# Altium schematic sheet 1_SCH_RP2040.schdoc
size 307 x 218 mm; Symbol: Sheet-Symbol_A4; Device: Sheet-Symbol_A4; Drawed: LCEDA_02; Version: V1.2; Page Size: A4; @Project Name: rp2040 board; @Page Count: 1; @Update Date: 2026-03-04; @Create Date: 2026-03-04; @Schematic Name: SCH_RP2040; Part Number: JLCPCB_01; @Page No: 1; @Page Name: SCH_RP2040; @Board Name: Board1; @Create Time: 12:52:45; @Update Time: 15:37:57; Width: 1170; Height: 825; Region Start: 1; X Region Count: 6; Y Region Count: 4; Blade Width: 10; Title Block Position: 3; Author: Shounak Das
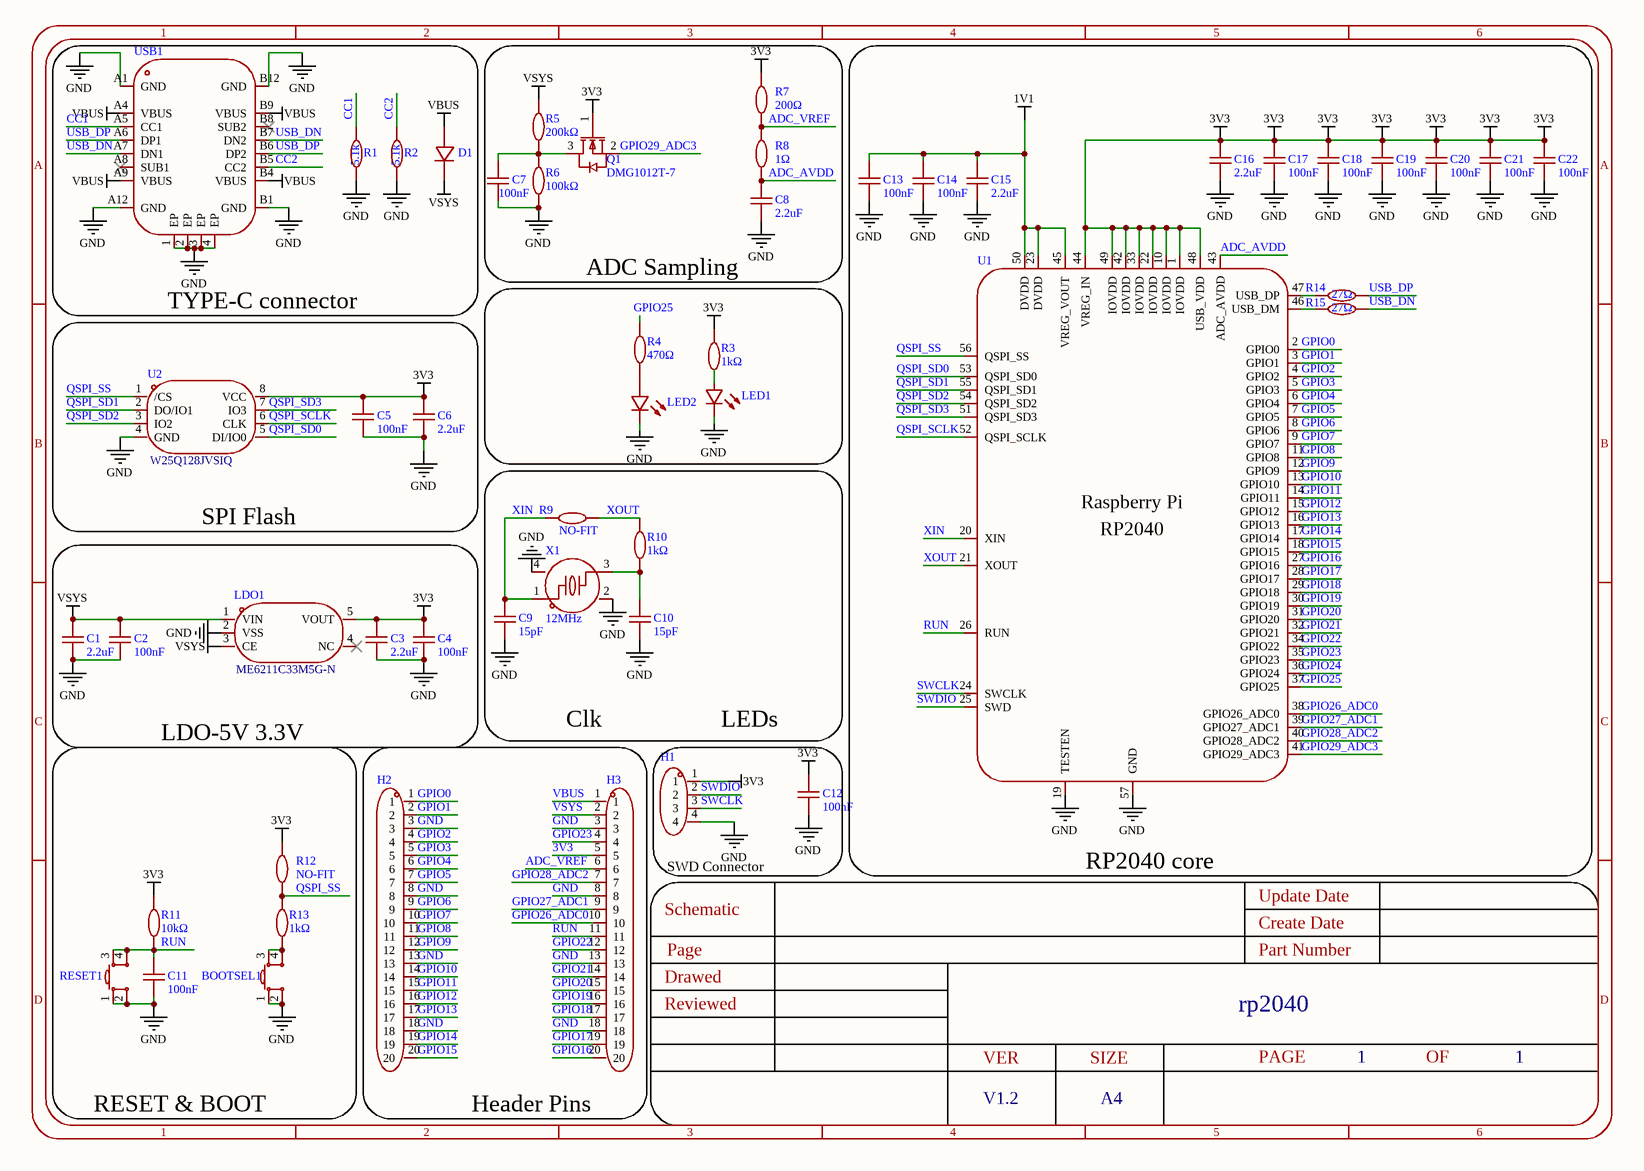
[diagram p0: 1_SCH_RP2040.schdoc]

## Parts
BOOTSEL1  PTS815SJK250SMTRLFS  [SW-SMD_4P-L4.2-W3.3-P2.15-LS5.1]  (value not drawn)
C1  2.2uF  [C0603]
C2  100nF  [C0603]
C3  2.2uF  [C0603]
C4  100nF  [C0603]
C5  100nF  [C0603]
C6  2.2uF  [C0603]
C7  100nF  [C0603]
C8  2.2uF  [C0603]
C9  15pF  [C0603]
C10  15pF  [C0603]
C11  100nF  [C0603]
C12  100nF  [C0603]
C13  100nF  [C0603]
C14  100nF  [C0603]
C15  2.2uF  [C0603]
C16  2.2uF  [C0603]
C17  100nF  [C0603]
C18  100nF  [C0603]
C19  100nF  [C0603]
C20  100nF  [C0603]
C21  100nF  [C0603]
C22  100nF  [C0603]
D1  1N4007W  [SOD-123FL_L2.7-W1.8-LS3.8-RD]  (value not drawn)
H1  DZ254W-11-04-65  [HDR-TH_4P-P2.54-H-M-W10.3]  (value not drawn)
H2  12251120CNG0S115005  [HDR-TH_20P-P2.54-V-M-1]  (value not drawn)
H3  12251120CNG0S115005  [HDR-TH_20P-P2.54-V-M-1]  (value not drawn)
LDO1  ME6211C33M5G-N  [SOT-23-5_L3.0-W1.7-P0.95-LS2.8-BR]
LED1  NCD0603R1  [LED0603-RD_RED]  (value not drawn)
LED2  19-217/BHC-ZL1M2RY/3T  [LED0603-R-RD_BLUE]  (value not drawn)
Q1  DMG1012T-7  [SOT-523-3_L1.6-W0.8-P1.00-LS1.6-BR]
R1  5.1k  [R0603]
R2  5.1k  [R0603]
R3  1kΩ  [R0603]
R4  470Ω  [R0603]
R5  200kΩ  [R0603]
R6  100kΩ  [R0603]
R7  200Ω  [R0603]
R8  1Ω  [R0603]
R9  NO-FIT  [R0603]
R10  1kΩ  [R0603]
R11  10kΩ  [R0603]
R12  NO-FIT  [R0603]
R13  1kΩ  [R0603]
R14  27Ω  [R0603]
R15  27Ω  [R0603]
RESET1  PTS815SJK250SMTRLFS  [SW-SMD_4P-L4.2-W3.3-P2.15-LS5.1]  (value not drawn)
U1  RP2040  [LQFN-56_L7.0-W7.0-P0.4-EP]  (value not drawn)
U2  W25Q128JVSIQ  [SOIC-8_L5.3-W5.3-P1.27-LS8.0-BL]
USB1  KH-TYPE-C-16P  [USB-C-SMD_KH-TYPE-C-16P]  (value not drawn)
X1  12MHz  [CRYSTAL-SMD_4P-L3.2-W2.5-BL]

## Blocks framed on the sheet
TYPE-C connector: D1 R1 R2 USB1
RP2040 core: C13-C22 R14 R15 U1
ADC Sampling: LED1 LED2 R3 R4
Clk: C9 C10 R9 R10 X1
Header Pins: H2 H3
LEDs: C12 H1

## Nets
1V1: C13.1 C14.2 C15.2 U1.23(DVDD) U1.45(VREG_VOUT) U1.50(DVDD)
3V3: C3.2 C4.2 C5.2 C6.2 C12.1 C16.1 C17.2 C18.2 C19.2 C20.2 C21.2 C22.2 H1.1 H3.5 LDO1.5(VOUT) Q1.1(G) R3.2 R7.2 R11.2 R12.1 U1.1(IOVDD) U1.10(IOVDD) U1.22(IOVDD) U1.33(IOVDD) U1.42(IOVDD) U1.44(VREG_IN) U1.48(USB_VDD) U1.49(IOVDD) U2.8(VCC)
GND: BOOTSEL1.1 BOOTSEL1.2 C1.1 C2.1 C3.1 C4.1 C5.1 C6.1 C7.1 C8.1 C9.2 C10.2 C11.1 C12.2 C13.2 C14.1 C15.1 C16.2 C17.1 C18.1 C19.1 C20.1 C21.1 C22.1 H1.4 H2.3 H2.8 H2.13 H2.18 H3.3 H3.8 H3.13 H3.18 LDO1.2(VSS) LED1.1(K) LED2.1(C) R1.1 R2.1 R6.1 RESET1.1 RESET1.2 U1.19(TESTEN) U1.57(GND) U2.4(GND) USB1.1(EP) USB1.2(EP) USB1.3(EP) USB1.4(EP) USB1.A1(GND) USB1.A12(GND) USB1.B1(GND) USB1.B12(GND) X1.2(GND) X1.4(GND)
VBUS: D1.2(A) H3.1 USB1.A4(VBUS) USB1.A9(VBUS) USB1.B4(VBUS) USB1.B9(VBUS)
VSYS: C1.2 C2.2 D1.1(K) H3.2 LDO1.1(VIN) LDO1.3(CE) R5.2
ADC_AVDD: C8.2 R8.1 U1.43(ADC_AVDD)
ADC_VREF: H3.6 R7.1 R8.2
CC1: R1.2 USB1.A5(CC1)
CC2: R2.2 USB1.B5(CC2)
GPIO0: H2.1 U1.2(GPIO0)
GPIO1: H2.2 U1.3(GPIO1)
GPIO2: H2.4 U1.4(GPIO2)
GPIO3: H2.5 U1.5(GPIO3)
GPIO4: H2.6 U1.6(GPIO4)
GPIO5: H2.7 U1.7(GPIO5)
GPIO6: H2.9 U1.8(GPIO6)
GPIO7: H2.10 U1.9(GPIO7)
GPIO8: H2.11 U1.11(GPIO8)
GPIO9: H2.12 U1.12(GPIO9)
GPIO10: H2.14 U1.13(GPIO10)
GPIO11: H2.15 U1.14(GPIO11)
GPIO12: H2.16 U1.15(GPIO12)
GPIO13: H2.17 U1.16(GPIO13)
GPIO14: H2.19 U1.17(GPIO14)
GPIO15: H2.20 U1.18(GPIO15)
GPIO16: H3.20 U1.27(GPIO16)
GPIO17: H3.19 U1.28(GPIO17)
GPIO18: H3.17 U1.29(GPIO18)
GPIO19: H3.16 U1.30(GPIO19)
GPIO20: H3.15 U1.31(GPIO20)
GPIO21: H3.14 U1.32(GPIO21)
GPIO22: H3.12 U1.34(GPIO22)
GPIO23: H3.4 U1.35(GPIO23)
GPIO24: U1.36(GPIO24)
GPIO25: U1.37(GPIO25)
GPIO26_ADC0: H3.10 U1.38(GPIO26_ADC0)
GPIO27_ADC1: H3.9 U1.39(GPIO27_ADC1)
GPIO28_ADC2: H3.7 U1.40(GPIO28_ADC2)
GPIO29_ADC3: Q1.2(S) U1.41(GPIO29_ADC3)
QSPI_SCLK: U1.52(QSPI_SCLK) U2.6(CLK)
QSPI_SD0: U1.53(QSPI_SD0) U2.5(DI/IO0)
QSPI_SD1: U1.55(QSPI_SD1) U2.2(DO/IO1)
QSPI_SD2: U1.54(QSPI_SD2) U2.3(IO2)
QSPI_SD3: U1.51(QSPI_SD3) U2.7(IO3)
QSPI_SS: R12.2 R13.2 U1.56(QSPI_SS) U2.1(/CS)
RUN: C11.2 H3.11 R11.1 RESET1.3 RESET1.4 U1.26(RUN)
SWCLK: H1.3 U1.24(SWCLK)
SWDIO: H1.2 U1.25(SWD)
USB_DN: R15.2 USB1.A7(DN1) USB1.B7(DN2)
USB_DP: R14.2 USB1.A6(DP1) USB1.B6(DP2)
XIN: C9.1 R9.1 U1.20(XIN) X1.1
XOUT: R9.2 R10.2 U1.21(XOUT)
NetBOOTSEL1_3: BOOTSEL1.3 BOOTSEL1.4 R13.1
NetC7_2: C7.2 Q1.3(D) R5.1 R6.2
NetC10_1: C10.1 R10.1 X1.3
NetLED1_2: LED1.2(A) R3.1
NetLED2_2: LED2.2(A) R4.1
NetR14_1: R14.1 U1.47(USB_DP)
NetR15_1: R15.1 U1.46(USB_DM)

Not connected (* = marked no-connect by the designer): LDO1 4(NC)*; R4 2; USB1 A8(SUB1)* B8(SUB2)*

## Notes on the sheet
- SPI Flash
- LDO-5V 3.3V
- SWD Connector
- RESET & BOOT
- Labels drawn without touching a wire or pin: GPIO25
- 1
- 2
- 3
- 4
- 5
- 6
- A
- B
- C
- Schematic
- Create Date
- Update Date
- Drawed
- Page
- Part Number
- D
- Reviewed
- VER
- SIZE
- PAGE
- rp2040
- OF
- V1.2
- A4
- (in symbol RP2040_C2040) Raspberry Pi

## Library data of the parts
BOOTSEL1 RESET1 = PTS815SJK250SMTRLFS: Manufacturer: C&K; Add into BOM: yes; Symbol: PTS815SJK250SMTRLFS; Device: PTS815SJK250SMTRLFS; LCSC Part Name: 轻触开关; Supplier Part: C918859; Manufacturer Part: PTS815SJK250SMTRLFS; Supplier Footprint: SMD; JLCPCB Part Class: 扩展库; Datasheet: https://atta.szlcsc.com/upload/public/pdf/source/20190916/C411883_4F77F16E1D8E48DC707D8949CEE7CF80.pdf; Supplier: LCSC; Convert to PCB: yes
C1 C3 C6 C8 C15 C16 = CL10A225KO8NNNC: Manufacturer: SAMSUNG(三星); Add into BOM: yes; Tolerance: ±10%; Voltage Rated: 16V; Temperature Coefficient: X5R; Symbol: CL10A225KO8NNNC; Device: CL10A225KO8NNNC; LCSC Part Name: 2.2uF ±10% 16V; Supplier Part: C23630; Manufacturer Part: CL10A225KO8NNNC; Supplier Footprint: 0603; JLCPCB Part Class: 基础库; Datasheet: https://atta.szlcsc.com/upload/public/pdf/source/20160103/1457707709512.pdf; Supplier: LCSC; Convert to PCB: yes; Value: 2.2uF
C2 C4 C5 C7 C11-C14 C17-C22 = 0603B104K500NT: Manufacturer: FH(风华); Add into BOM: yes; Tolerance: ±10%; Voltage Rated: 50V; Temperature Coefficient: X7R; Symbol: 0603B104K500NT; Device: 0603B104K500NT; LCSC Part Name: 100nF ±10% 50V; Supplier Part: C30926; Manufacturer Part: 0603B104K500NT; Supplier Footprint: 0603; JLCPCB Part Class: 扩展库; Datasheet: https://atta.szlcsc.com/upload/public/pdf/source/20170923/C30926_1506149436298988724.pdf; Supplier: LCSC; Convert to PCB: yes; Value: 100nF
C9 C10 = CC0603JRNPO9BN150: Manufacturer: YAGEO(国巨); Add into BOM: yes; Tolerance: ±5%; Voltage Rated: 50V; Temperature Coefficient: NP0; Symbol: CC0603JRNPO9BN150; Device: CC0603JRNPO9BN150; LCSC Part Name: 15pF ±5% 50V; Supplier Part: C107037; Manufacturer Part: CC0603JRNPO9BN150; Supplier Footprint: 0603; JLCPCB Part Class: 扩展库; Datasheet: https://atta.szlcsc.com/upload/public/pdf/source/20170420/1492670688140.pdf; Supplier: LCSC; Convert to PCB: yes; Value: 15pF
D1 = 1N4007W_C108803: Manufacturer: 晶导微电子; Add into BOM: yes; Diode Configuration: 独立式; Reverse Voltage (Vr): 1kV; Average Rectified Current (Io): 1A; Forward Voltage (Vf@If): 1.1V@1A; Reverse Leakage Current: 5uA@1kV; Symbol: 1N4007W; Device: 1N4007W_C108803; LCSC Part Name: 1kV 1A 1.1V@1A; Supplier Part: C108803; Manufacturer Part: 1N4007W; Supplier Footprint: SOD-123FL; JLCPCB Part Class: 扩展库; Datasheet: https://atta.szlcsc.com/upload/public/pdf/source/20170418/1492506332394.pdf; Supplier: LCSC; Convert to PCB: yes
H1 = DZ254W-11-04-65: Manufacturer: DEALON(德艺隆); Add into BOM: yes; Pitch: 2.54mm; Pin Structure: 1x4P; Circluar Pins/Square Pins: 方针; Current Rating (Max): 3A; Symbol: DZ254W-11-04-65; Device: DZ254W-11-04-65; LCSC Part Name: 2.54mm 1x4P 弯插 方针; Supplier Part: C2935929; Manufacturer Part: DZ254W-11-04-65; Supplier Footprint: 弯插,P=2.54mm; JLCPCB Part Class: 扩展库; Datasheet: https://atta.szlcsc.com/upload/public/pdf/source/20211231/CEC96EEC99F3217E207F74B399519373.pdf; Supplier: LCSC; Convert to PCB: yes; Number of Pins: 4; Number of Rows: 1; Row Spacing: -; Mounting Type: 弯插; Voltage Rating (Max): -; Length of Mating Pin: 6mm; Insulation Height: 2.54mm; Length of End Connection Pin: -; Operating Temperature Range: -; Color: -
H2 H3 = 12251120CNG0S115005: Manufacturer: JILN(锦凌); Add into BOM: yes; Pitch: 2.54mm; Pin Structure: 1x20P; Circluar Pins/Square Pins: 方针; Current Rating (Max): 3A; Symbol: 12251120CNG0S115005; Device: 12251120CNG0S115005; LCSC Part Name: 2.54mm 1x20P 直插 方针; Supplier Part: C429964; Manufacturer Part: 12251120CNG0S115005; Supplier Footprint: 插件,P=2.54mm; JLCPCB Part Class: 扩展库; Datasheet: https://atta.szlcsc.com/upload/public/pdf/source/20190920/C429964_97CF577D001CBBD1C5ADC89AE690F8A2.pdf; Supplier: LCSC; Convert to PCB: yes; Number of Pins: 20; Number of Rows: 1; Row Spacing: -; Mounting Type: 直插; Voltage Rating (Max): -; Length of Mating Pin: 6mm; Insulation Height: 2.5mm; Length of End Connection Pin: 3mm; Contact Material: 黄铜; Contact Plating: -; Operating Temperature Range: -40~+105; Color: 黑色
LDO1 = ME6211C33M5G-N: Manufacturer: MICRONE(南京微盟); Add into BOM: yes; Output Type: 固定; Output Polarity: 正; Number of Outputs: 1; Maximum Input Voltage: 6V; Output Voltage: 3.3V; Dropout Voltage: 260mV@(200mA); Output Current: 500mA; Power Supply Rejection Ratio (PRSS): 70dB@(1kHz),62dB@(10kHz); Symbol: ME6211C33M5G-N; Device: ME6211C33M5G-N; LCSC Part Name: Vin=6V Vout=3.3V 500mA 70dB@(1kHz),62dB@(10kHz); Supplier Part: C82942; Manufacturer Part: ME6211C33M5G-N; Supplier Footprint: SOT-23-5; JLCPCB Part Class: 扩展库; Datasheet: https://atta.szlcsc.com/upload/public/pdf/source/20170918/C82942_1505727073070976520.pdf; Supplier: LCSC; Convert to PCB: yes
LED1 = NCD0603R1_C84263: Manufacturer: 国星光电; Symbol: FC-DA1608HRK-620D; Add into BOM: yes; Emitted Color: 红灯; Device: NCD0603R1_C84263; LCSC Part Name: 红灯; Supplier Part: C84263; Manufacturer Part: NCD0603R1; Supplier Footprint: 0603; JLCPCB Part Class: 扩展库; Datasheet: https://atta.szlcsc.com/upload/public/pdf/source/20200820/C84263_DABC6A75E58F576973B407FDBA283D60.pdf; Supplier: LCSC; Convert to PCB: yes
LED2 = 19-217/BHC-ZL1M2RY/3T: Manufacturer: EVERLIGHT(亿光); Add into BOM: yes; Emitted Color: 蓝灯; Lens Color: 无色透明; Dominant Wavelength: 465nm~475nm; Peak Wavelength: 468nm; Forward Current: 5mA; Power Dissipation: 110mW; Viewing Angle: 120°; Symbol: 19-217/BHC-ZL1M2RY/3T; Device: 19-217/BHC-ZL1M2RY/3T; LCSC Part Name: 蓝灯 465nm~475nm; Supplier Part: C72041; Manufacturer Part: 19-217/BHC-ZL1M2RY/3T; Supplier Footprint: 0603; JLCPCB Part Class: 基础库; Datasheet: https://atta.szlcsc.com/upload/public/pdf/source/20170116/1484561237273.pdf; Supplier: LCSC; Convert to PCB: yes; Diode Configuration: -; Color Temperature: -; Mounting Sytle: -; Operating Temperature: -40℃~+85℃
Q1 = DMG1012T-7: Manufacturer: DIODES(美台); Add into BOM: yes; Type: N沟道; Drain Source Voltage (Vdss): 20V; Continuous Drain Current (Id): 630mA; Power Dissipation (Pd): 280mW; Drain Source On Resistance (RDS(on)@Vgs,Id): 400mΩ@4.5V,600mA; Gate Threshold Voltage (Vgs(th)@Id): 1V@250A; Symbol: DMG1012T-7; Device: DMG1012T-7; LCSC Part Name: N沟道 20V 630mA; Supplier Part: C20512; Manufacturer Part: DMG1012T-7; Supplier Footprint: SOT-523; JLCPCB Part Class: 扩展库; Datasheet: https://atta.szlcsc.com/upload/public/pdf/source/20170427/1493286410765.pdf; Supplier: LCSC; Convert to PCB: yes
R1 R2 = RC0603FR-075K1L: Manufacturer: YAGEO(国巨); Add into BOM: yes; Tolerance: ±1%; Power(Watts): 100mW; Temperature Coefficient: ±100ppm/℃; Overload Voltage (Max): 75V; Symbol: RC0603FR-075K1L; Device: RC0603FR-075K1L; LCSC Part Name: 5.1kΩ ±1% 100mW; Supplier Part: C105580; Manufacturer Part: RC0603FR-075K1L; Supplier Footprint: 0603; JLCPCB Part Class: 扩展库; Datasheet: https://atta.szlcsc.com/upload/public/pdf/source/20170428/1493376741323.pdf; Supplier: LCSC; Convert to PCB: yes; Type: 厚膜电阻; Value: 5.1k; Operating Temperature Range: -55℃~+155℃
R3 R10 R13 = RC0603FR-071KL: Manufacturer: YAGEO(国巨); Add into BOM: yes; Tolerance: ±1%; Power(Watts): 100mW; Temperature Coefficient: ±100ppm/℃; Overload Voltage (Max): 75V; Symbol: RC0603FR-071KL; Device: RC0603FR-071KL; LCSC Part Name: 1kΩ ±1% 100mW; Supplier Part: C22548; Manufacturer Part: RC0603FR-071KL; Supplier Footprint: 0603; JLCPCB Part Class: 扩展库; Datasheet: https://atta.szlcsc.com/upload/public/pdf/source/20180312/7BD3618A8B6324EA6280B0497A051AB7.pdf; Supplier: LCSC; Convert to PCB: yes; Type: 厚膜电阻; Value: 1kΩ; Operating Temperature Range: -55℃~+155℃
R4 = RC0603FR-07470RL: Manufacturer: YAGEO(国巨); Add into BOM: yes; Tolerance: ±1%; Power(Watts): 100mW; Temperature Coefficient: ±100ppm/℃; Overload Voltage (Max): 75V; Symbol: RC0603FR-07470RL; Device: RC0603FR-07470RL; LCSC Part Name: 470Ω ±1% 100mW; Supplier Part: C114669; Manufacturer Part: RC0603FR-07470RL; Supplier Footprint: 0603; JLCPCB Part Class: 扩展库; Datasheet: https://atta.szlcsc.com/upload/public/pdf/source/20170810/C114669_1502335168334879689.pdf; Supplier: LCSC; Convert to PCB: yes; Type: 厚膜电阻; Value: 470Ω; Operating Temperature Range: -55℃~+155℃
R5 = RC0603FR-07200KL: Manufacturer: YAGEO(国巨); Add into BOM: yes; Tolerance: ±1%; Power(Watts): 100mW; Temperature Coefficient: ±100ppm/℃; Overload Voltage (Max): 75V; Symbol: RC0603FR-07200KL; Device: RC0603FR-07200KL; LCSC Part Name: 200kΩ ±1% 100mW; Supplier Part: C105574; Manufacturer Part: RC0603FR-07200KL; Supplier Footprint: 0603; JLCPCB Part Class: 扩展库; Datasheet: https://atta.szlcsc.com/upload/public/pdf/source/20170818/C105574_1503051100367895048.pdf; Supplier: LCSC; Convert to PCB: yes; Type: 厚膜电阻; Value: 200kΩ; Operating Temperature Range: -55℃~+155℃
R6 = RC0603FR-07100KL: Manufacturer: YAGEO(国巨); Add into BOM: yes; Tolerance: ±1%; Power(Watts): 100mW; Temperature Coefficient: ±100ppm/℃; Overload Voltage (Max): 75V; Symbol: RC0603FR-07100KL; Device: RC0603FR-07100KL; LCSC Part Name: 100kΩ ±1% 100mW; Supplier Part: C14675; Manufacturer Part: RC0603FR-07100KL; Supplier Footprint: 0603; JLCPCB Part Class: 扩展库; Datasheet: https://atta.szlcsc.com/upload/public/pdf/source/20140324/1457707028752.pdf; Supplier: LCSC; Convert to PCB: yes; Type: 厚膜电阻; Value: 100kΩ; Operating Temperature Range: -55℃~+155℃
R7 = RC0603FR-07200RL: Manufacturer: YAGEO(国巨); Add into BOM: yes; Tolerance: ±1%; Power(Watts): 100mW; Temperature Coefficient: ±100ppm/℃; Overload Voltage (Max): 75V; Symbol: RC0603FR-07200RL; Device: RC0603FR-07200RL; LCSC Part Name: 200Ω ±1% 100mW; Supplier Part: C114664; Manufacturer Part: RC0603FR-07200RL; Supplier Footprint: 0603; JLCPCB Part Class: 扩展库; Datasheet: https://atta.szlcsc.com/upload/public/pdf/source/20170912/C114664_1505207802969963457.pdf; Supplier: LCSC; Convert to PCB: yes; Value: 200Ω; Operating Temperature Range: -55℃~+155℃
R8 = RC0603FR-071RL: Manufacturer: YAGEO(国巨); Add into BOM: yes; Tolerance: ±1%; Power(Watts): 100mW; Temperature Coefficient: ±200ppm/℃; Overload Voltage (Max): 75V; Symbol: RC0603FR-071RL; Device: RC0603FR-071RL; LCSC Part Name: 1Ω ±1% 100mW; Supplier Part: C112305; Manufacturer Part: RC0603FR-071RL; Supplier Footprint: 0603; JLCPCB Part Class: 扩展库; Datasheet: https://atta.szlcsc.com/upload/public/pdf/source/20170912/C112305_1505207747699963377.pdf; Supplier: LCSC; Convert to PCB: yes; Type: 厚膜电阻; Value: 1Ω; Operating Temperature Range: -55℃~+155℃
R9 R12 = RC0603FR-071KL: Add into BOM: yes; Symbol: RC0603FR-071KL; Device: RC0603FR-071KL; Supplier Footprint: 0603; JLCPCB Part Class: 扩展库; Datasheet: https://atta.szlcsc.com/upload/public/pdf/source/20180312/7BD3618A8B6324EA6280B0497A051AB7.pdf; Supplier: LCSC; Convert to PCB: yes; Type: 厚膜电阻; Value: NO-FIT
R11 = 0603WAF1002T5E: Manufacturer: UNI-ROYAL(厚声); Add into BOM: yes; Tolerance: ±1%; Power(Watts): 100mW; Temperature Coefficient: ±100ppm/℃; Overload Voltage (Max): 75V; Symbol: 0603WAF1002T5E; Device: 0603WAF1002T5E; LCSC Part Name: 10kΩ ±1% 100mW; Supplier Part: C25804; Manufacturer Part: 0603WAF1002T5E; Supplier Footprint: 0603; JLCPCB Part Class: 基础库; Datasheet: https://atta.szlcsc.com/upload/public/pdf/source/20200306/C422600_1E6D84923E4A46A82E41ADD87F860B5C.pdf; Supplier: LCSC; Convert to PCB: yes; Type: 厚膜电阻; Value: 10kΩ; Operating Temperature Range: -55℃~+155℃
R14 R15 = 0603WAF270JT5E: Manufacturer: UNI-ROYAL(厚声); Add into BOM: yes; Tolerance: ±1%; Power(Watts): 100mW; Temperature Coefficient: ±200ppm/℃; Overload Voltage (Max): 75V; Symbol: 0603WAF270JT5E; Device: 0603WAF270JT5E; LCSC Part Name: 27Ω ±1% 100mW; Supplier Part: C25190; Manufacturer Part: 0603WAF270JT5E; Supplier Footprint: 0603; Datasheet: https://atta.szlcsc.com/upload/public/pdf/source/20200306/C422600_1E6D84923E4A46A82E41ADD87F860B5C.pdf; Supplier: LCSC; Convert to PCB: yes; Type: 厚膜电阻; Value: 27Ω; Operating Temperature Range: -55℃~+155℃
U1 = RP2040_C2040: Manufacturer: Raspberry Pi(树莓派); Add into BOM: yes; CPU Maximum Speed: 133MHz; Number of I/O: 30; ADC (Bit): 12bit; Symbol: RP2040; Device: RP2040_C2040; LCSC Part Name: RP2040（RP2B2）; Supplier Part: C2040; Manufacturer Part: RP2040; Supplier Footprint: LQFN-56(7x7); JLCPCB Part Class: Extended Part; Datasheet: https://item.szlcsc.com/datasheet/RP2040/2392.html; Supplier: LCSC; Convert to PCB: yes; CPU Core: -
U2 = W25Q128JVSIQ: Manufacturer: WINBOND(华邦); Symbol: W25Q16JVSSIQ; Add into BOM: yes; Device: W25Q128JVSIQ; LCSC Part Name: W25Q128JVSIQ; Supplier Part: C97521; Manufacturer Part: W25Q128JVSIQ; Supplier Footprint: SOIC-8-208mil; JLCPCB Part Class: Basic Part; Datasheet: https://atta.szlcsc.com/upload/public/pdf/source/20170316/1489627409956.pdf; Supplier: LCSC; Convert to PCB: yes
USB1 = KH-TYPE-C-16P: Manufacturer: kinghelm(金航标); Add into BOM: yes; Connector Type: Type-C; Gender: 母座; Number of Contacts: 16; Number of Ports: 1; Current Rating - Power (Max): 3A; Symbol: KH-TYPE-C-16P; Device: KH-TYPE-C-16P; LCSC Part Name: Type-C 母座 卧贴; Supplier Part: C709357; Manufacturer Part: KH-TYPE-C-16P; Supplier Footprint: SMD; JLCPCB Part Class: 扩展库; Datasheet: https://atta.szlcsc.com/upload/public/pdf/source/20200911/C709357_AA8DCEB38BB20E3035A7ED7AE7667837.pdf; Supplier: LCSC; Convert to PCB: yes; Standard: -; Mounting Style: 卧贴; Operating Temperature Range: -40℃~+85℃
X1 = XC32M4-12.000-F10NNFT: Manufacturer: HCI(杭晶); Add into BOM: yes; Crystal Type: 贴片无源晶振; Frequency Tolerance: ±10ppm; Load Capacitance: 10pF; Equivalent Series Resistance (ESR): 100Ω; Symbol: XC32M4-12.000-F10NNFT; Device: XC32M4-12.000-F10NNFT; LCSC Part Name: 12MHz ±10ppm 10pF; Supplier Part: C2842186; Manufacturer Part: XC32M4-12.000-F10NNFT; Supplier Footprint: SMD3225-4P; JLCPCB Part Class: 扩展库; Datasheet: https://atta.szlcsc.com/upload/public/pdf/source/20220525/43C7A5B871DF4E364F96CDE8B1430A73.pdf; Supplier: LCSC; Convert to PCB: yes; Value: 12MHz; Frequency Stability: ±10ppm; Operating Temperature: -30℃~+85℃